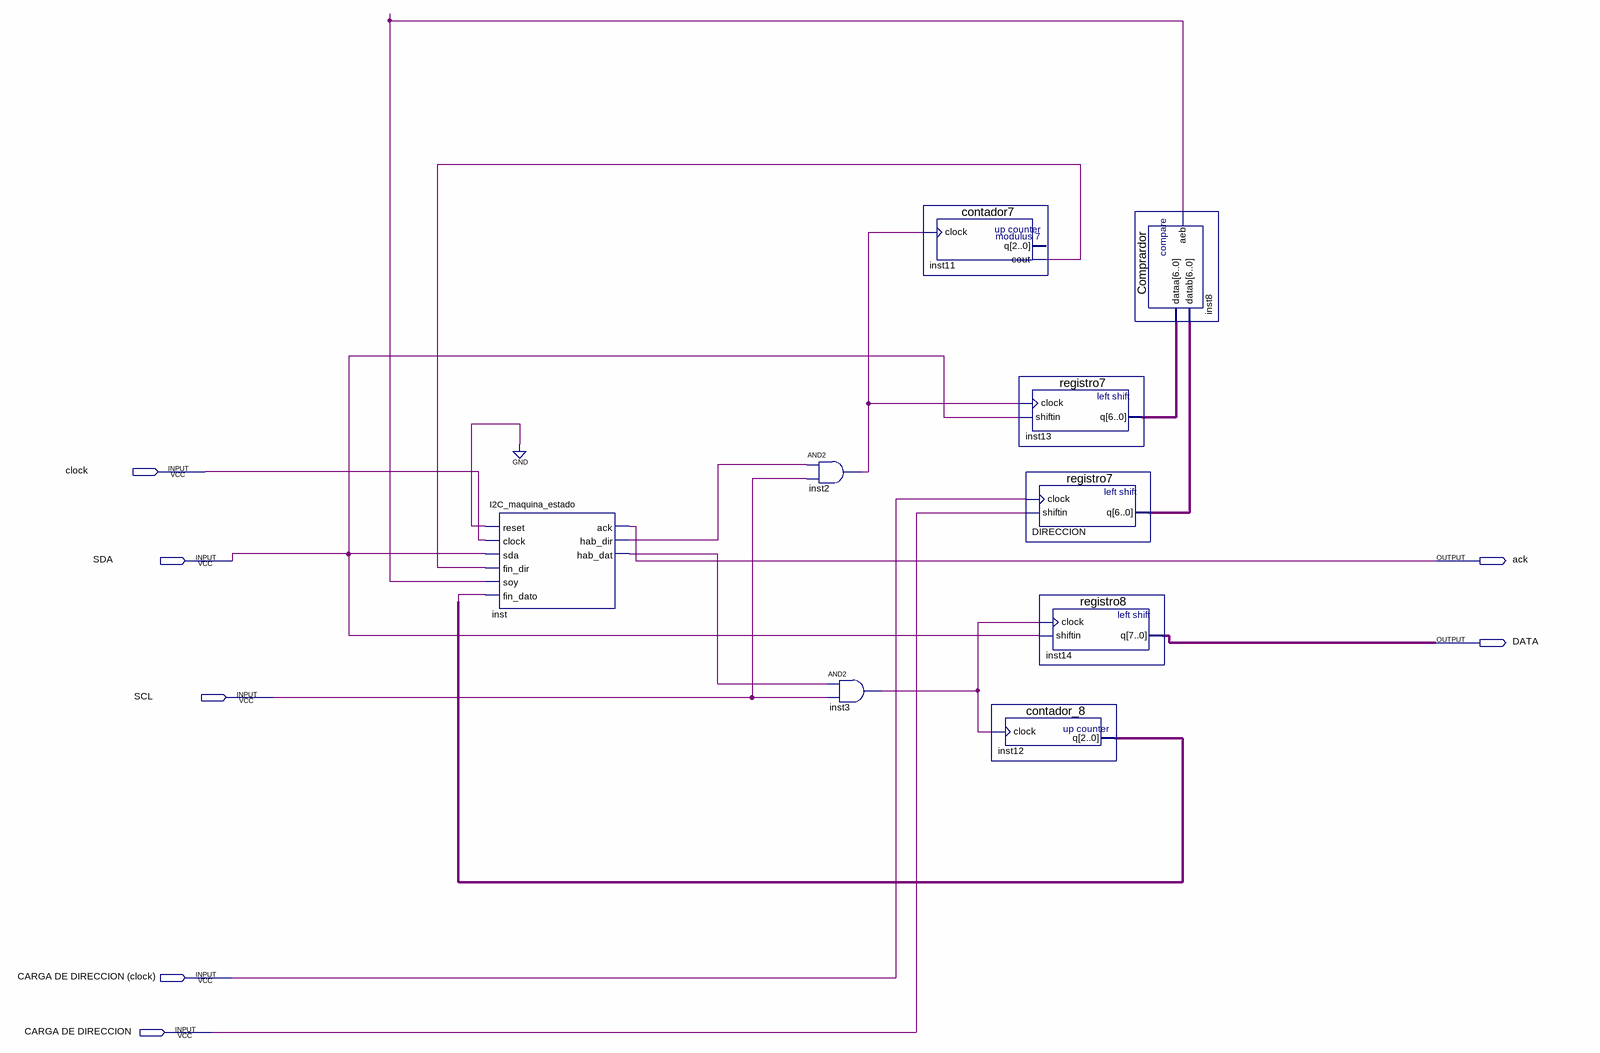
[diagram p0: schematic sheet]
// Quartus schematic bloque_maquina_estado.bdf as structural Verilog: 9 symbols, 7 pins
module bloque_maquina_estado (
  input  clock,
  input  SDA,
  input  SCL,
  input  \CARGA_DE_DIRECCION_(clock) ,
  input  \CARGA_DE_DIRECCION ,
  output ack,
  output DATA
);

  wire inst2_out, inst3_out, inst8_aeb, inst11_cout, inst_hab_dat, inst_hab_dir, undriven;
  wire [2:0] inst12_q;
  wire [6:0] DIRECCION_q, inst13_q;
  wire [7:0] inst14_q;

  I2C_maquina_estado inst (
    .reset(1'b0), .clock(clock), .sda(SDA), .fin_dir(inst11_cout), .soy(inst8_aeb), .fin_dato(undriven),
    .ack(ack), .hab_dir(inst_hab_dir), .hab_dat(inst_hab_dat));
  and inst2 (inst2_out, inst_hab_dir, SCL);
  and inst3 (inst3_out, inst_hab_dat, SCL);
  contador7 inst11 (.clock(inst2_out), .cout(inst11_cout));  // open: q
  registro7 inst13 (.clock(inst2_out), .shiftin(SDA), .q(inst13_q));
  contador_8 inst12 (.clock(inst3_out), .q(inst12_q));
  registro7 DIRECCION (.clock(\CARGA_DE_DIRECCION_(clock) ), .shiftin(\CARGA_DE_DIRECCION ), .q(DIRECCION_q));
  registro8 inst14 (.clock(inst3_out), .shiftin(SDA), .q(inst14_q));
  Comprardor inst8 (.dataa(inst13_q), .datab(DIRECCION_q), .aeb(inst8_aeb));
endmodule
